# Altium schematic sheet Main.SchDoc
size A3; SheetNumber: 1; SheetTotal: 13
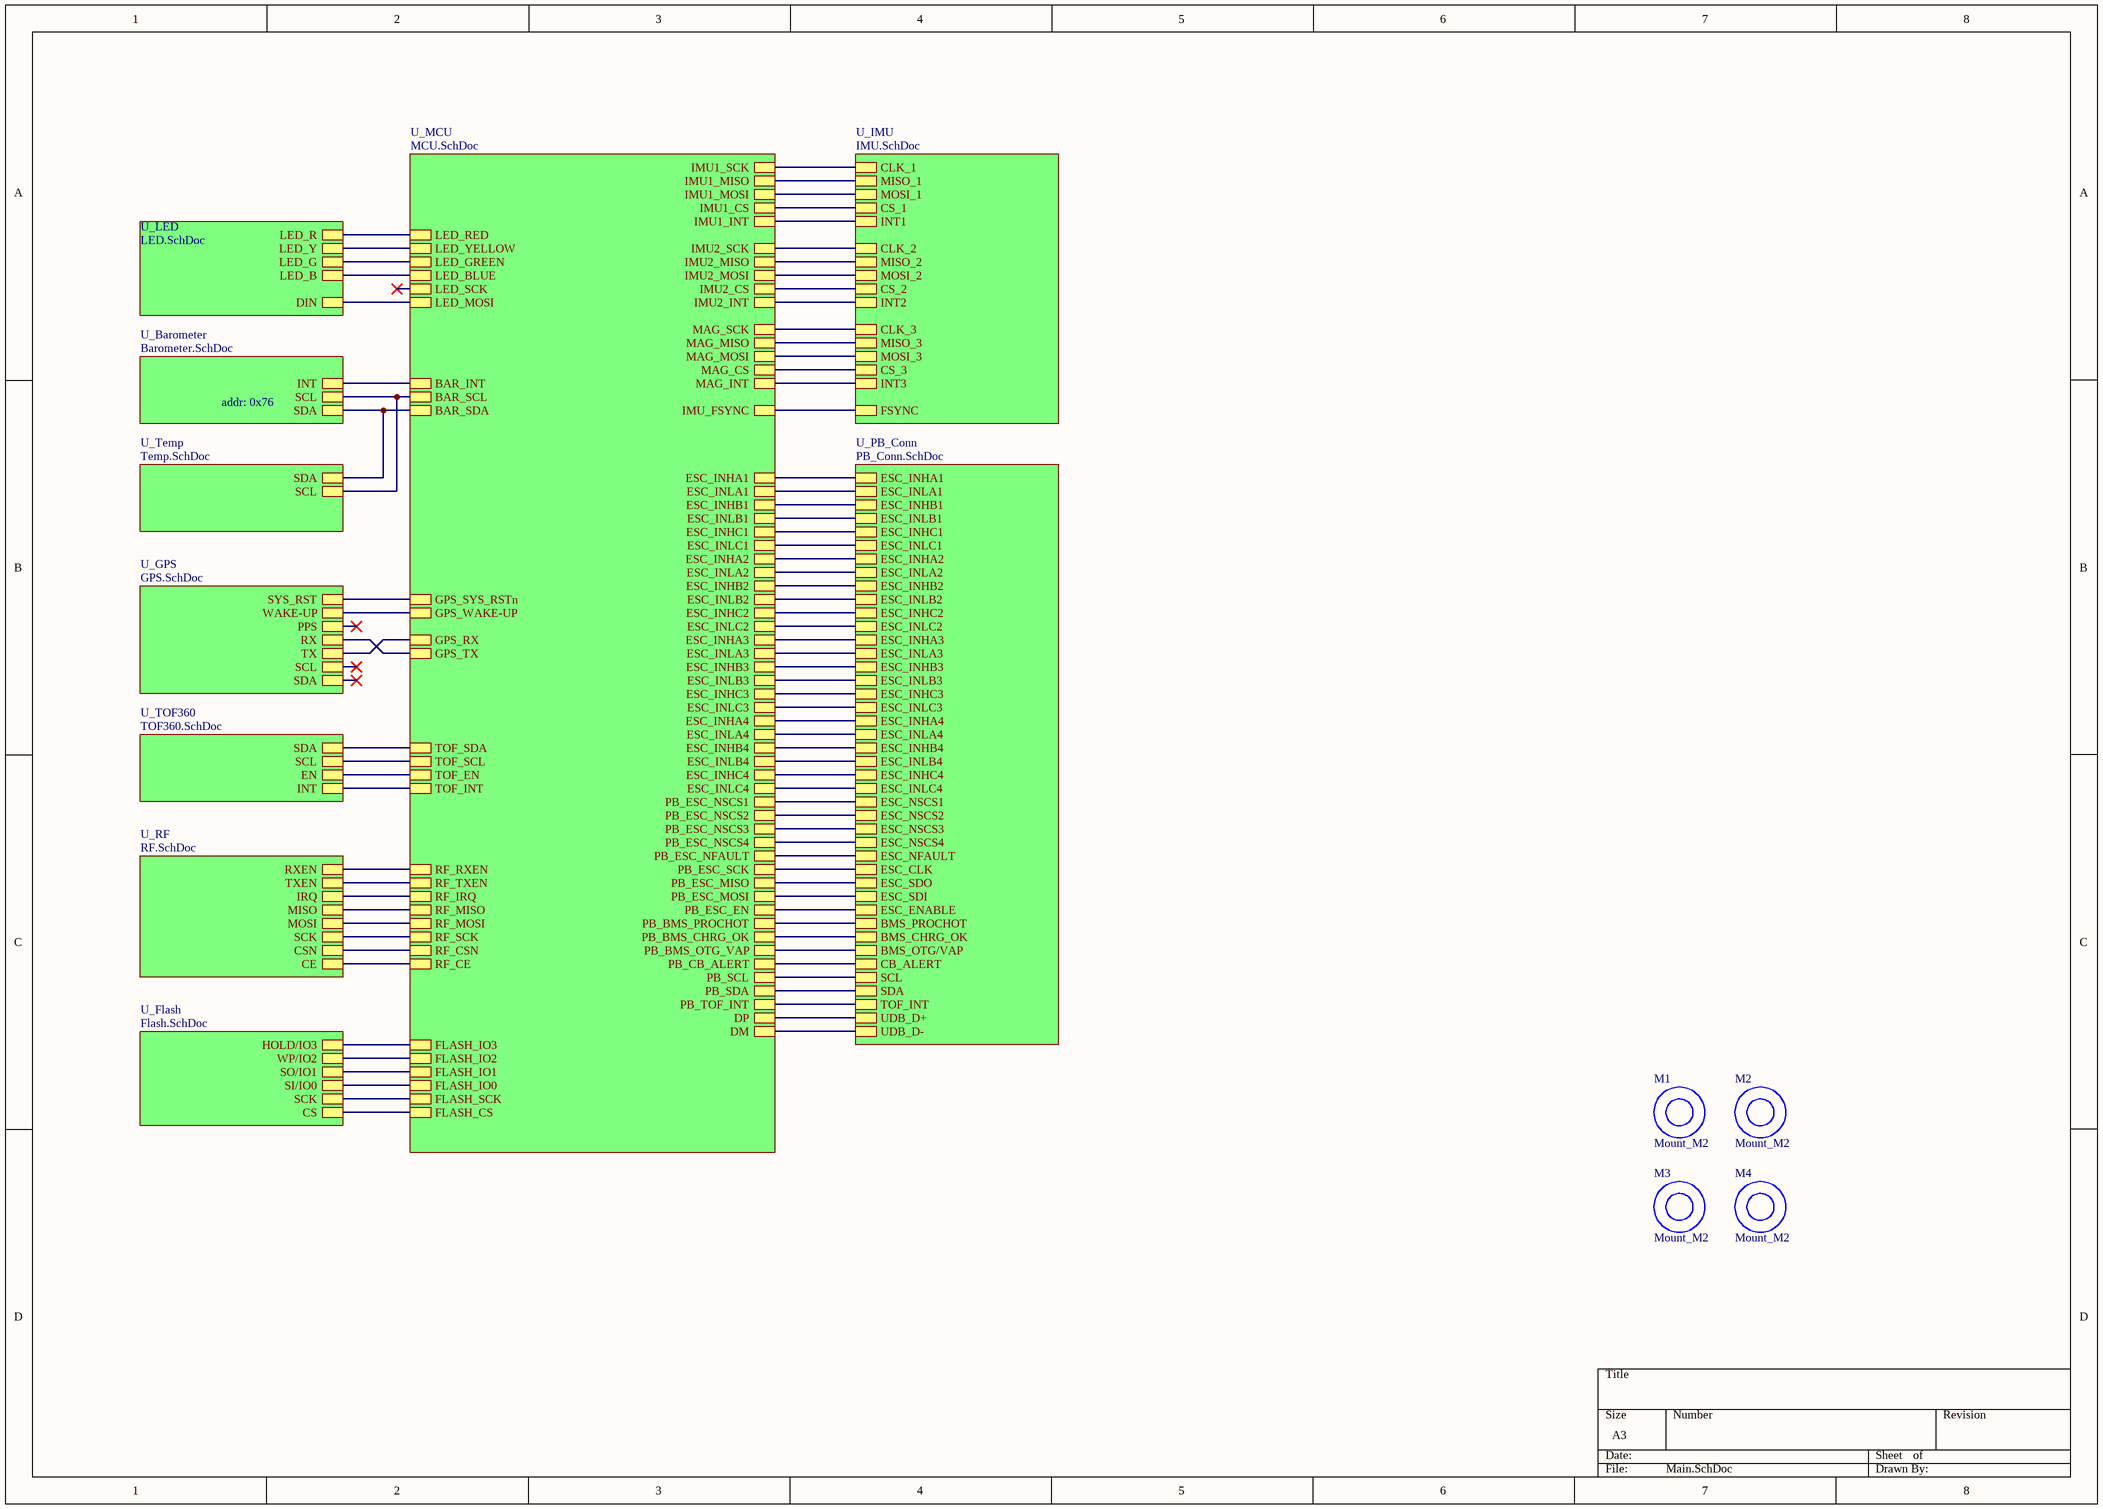
[diagram p0: Main.SchDoc]

## Parts
M1  Mount_M2  [Mount_M2_anti_vibration_rubber]
M2  Mount_M2  [Mount_M2_anti_vibration_rubber]
M3  Mount_M2  [Mount_M2_anti_vibration_rubber]
M4  Mount_M2  [Mount_M2_anti_vibration_rubber]

## Sub-sheets
U_Barometer = Barometer.SchDoc: SDA, SCL, INT
U_Flash = Flash.SchDoc: CS, SO/IO1, WP/IO2, HOLD/IO3, SCK, SI/IO0
U_GPS = GPS.SchDoc: SDA, SCL, TX, RX, PPS, WAKE-UP, SYS_RST
U_IMU = IMU.SchDoc: INT1, INT2, MISO_1, MOSI_1, CS_1, CLK_1, FSYNC, MISO_2, MOSI_2, CS_2, CLK_2, MOSI_3, CS_3, CLK_3, MISO_3, INT3
U_LED = LED.SchDoc: DIN, LED_R, LED_G, LED_Y, LED_B
U_MCU = MCU.SchDoc: DP, DM, TOF_SDA, TOF_SCL, TOF_EN, TOF_INT, ESC_INHA1, ESC_INHA2, ESC_INHA3, ESC_INHA4, ESC_INHB1, ESC_INHC1, ESC_INHB2, ESC_INHB3, ESC_INHB4, ESC_INHC2, ESC_INHC3, ESC_INHC4, ESC_INLA1, ESC_INLB1, ESC_INLC1, ESC_INLA2, ESC_INLA3, ESC_INLA4, ESC_INLB2, ESC_INLB3, ESC_INLB4, ESC_INLC2, ESC_INLC3, ESC_INLC4, RF_IRQ, RF_CSN, RF_MOSI, RF_MISO, RF_SCK, RF_CE, RF_RXEN, RF_TXEN, PB_SCL, PB_SDA, PB_TOF_INT, PB_ESC_EN, PB_ESC_SCK, PB_ESC_MISO, PB_ESC_MOSI, PB_ESC_NSCS1, PB_ESC_NSCS2, PB_ESC_NSCS3, PB_ESC_NSCS4, PB_BMS_PROCHOT, PB_BMS_OTG_VAP, PB_BMS_CHRG_OK, PB_CB_ALERT, PB_ESC_NFAULT, FLASH_IO0, FLASH_IO1, FLASH_IO2, FLASH_IO3, FLASH_SCK, FLASH_CS, GPS_RX, GPS_TX, GPS_WAKE-UP, GPS_SYS_RSTn, BAR_SCL, BAR_SDA, BAR_INT, LED_MOSI, LED_SCK, LED_RED, LED_GREEN, IMU1_SCK, IMU1_MISO, IMU1_MOSI, IMU1_CS, IMU1_INT, IMU2_INT, IMU2_SCK, IMU2_MISO, IMU2_MOSI, IMU2_CS, MAG_SCK, MAG_MISO, MAG_MOSI, MAG_CS, MAG_INT, IMU_FSYNC, LED_YELLOW, LED_BLUE
U_PB_Conn = PB_Conn.SchDoc: ESC_INLA1, ESC_INLB1, ESC_INLC1, ESC_INLA2, ESC_INLB2, ESC_INLC2, ESC_INLA3, ESC_INLB3, ESC_INLC3, ESC_INHA4, ESC_INLB4, ESC_INLC4, ESC_NSCS1, ESC_INHA1, ESC_INHB1, ESC_INHC1, ESC_INHA2, ESC_INHB2, ESC_INHC2, ESC_INHA3, ESC_INHB3, ESC_INHC3, ESC_INLA4, ESC_INHB4, ESC_INHC4, ESC_NSCS2, ESC_NSCS3, ESC_NSCS4, ESC_NFAULT, ESC_CLK, ESC_SDO, ESC_SDI, ESC_ENABLE, BMS_PROCHOT, BMS_CHRG_OK, BMS_OTG/VAP, CB_ALERT, SCL, SDA, TOF_INT, UDB_D+, UDB_D-
U_RF = RF.SchDoc: CE, CSN, SCK, MOSI, MISO, IRQ, TXEN, RXEN
U_Temp = Temp.SchDoc: SDA, SCL
U_TOF360 = TOF360.SchDoc: INT, SCL, SDA, EN

## Nets
(unnamed): sheet U_MCU/DP, sheet U_PB_Conn/UDB_D+
(unnamed): sheet U_MCU/DM, sheet U_PB_Conn/UDB_D-
(unnamed): sheet U_MCU/TOF_SDA, sheet U_TOF360/SDA
(unnamed): sheet U_MCU/TOF_SCL, sheet U_TOF360/SCL
(unnamed): sheet U_MCU/TOF_EN, sheet U_TOF360/EN
(unnamed): sheet U_MCU/TOF_INT, sheet U_TOF360/INT
(unnamed): sheet U_MCU/ESC_INHA1, sheet U_PB_Conn/ESC_INHA1
(unnamed): sheet U_MCU/ESC_INHA2, sheet U_PB_Conn/ESC_INHA2
(unnamed): sheet U_MCU/ESC_INHA3, sheet U_PB_Conn/ESC_INHA3
(unnamed): sheet U_MCU/ESC_INHA4, sheet U_PB_Conn/ESC_INHA4
(unnamed): sheet U_MCU/ESC_INHB1, sheet U_PB_Conn/ESC_INHB1
(unnamed): sheet U_MCU/ESC_INHC1, sheet U_PB_Conn/ESC_INHC1
(unnamed): sheet U_MCU/ESC_INHB2, sheet U_PB_Conn/ESC_INHB2
(unnamed): sheet U_MCU/ESC_INHB3, sheet U_PB_Conn/ESC_INHB3
(unnamed): sheet U_MCU/ESC_INHB4, sheet U_PB_Conn/ESC_INHB4
(unnamed): sheet U_MCU/ESC_INHC2, sheet U_PB_Conn/ESC_INHC2
(unnamed): sheet U_MCU/ESC_INHC3, sheet U_PB_Conn/ESC_INHC3
(unnamed): sheet U_MCU/ESC_INHC4, sheet U_PB_Conn/ESC_INHC4
(unnamed): sheet U_MCU/ESC_INLA1, sheet U_PB_Conn/ESC_INLA1
(unnamed): sheet U_MCU/ESC_INLB1, sheet U_PB_Conn/ESC_INLB1
(unnamed): sheet U_MCU/ESC_INLC1, sheet U_PB_Conn/ESC_INLC1
(unnamed): sheet U_MCU/ESC_INLA2, sheet U_PB_Conn/ESC_INLA2
(unnamed): sheet U_MCU/ESC_INLA3, sheet U_PB_Conn/ESC_INLA3
(unnamed): sheet U_MCU/ESC_INLA4, sheet U_PB_Conn/ESC_INLA4
(unnamed): sheet U_MCU/ESC_INLB2, sheet U_PB_Conn/ESC_INLB2
(unnamed): sheet U_MCU/ESC_INLB3, sheet U_PB_Conn/ESC_INLB3
(unnamed): sheet U_MCU/ESC_INLB4, sheet U_PB_Conn/ESC_INLB4
(unnamed): sheet U_MCU/ESC_INLC2, sheet U_PB_Conn/ESC_INLC2
(unnamed): sheet U_MCU/ESC_INLC3, sheet U_PB_Conn/ESC_INLC3
(unnamed): sheet U_MCU/ESC_INLC4, sheet U_PB_Conn/ESC_INLC4
(unnamed): sheet U_MCU/RF_IRQ, sheet U_RF/IRQ
(unnamed): sheet U_MCU/RF_CSN, sheet U_RF/CSN
(unnamed): sheet U_MCU/RF_MOSI, sheet U_RF/MOSI
(unnamed): sheet U_MCU/RF_MISO, sheet U_RF/MISO
(unnamed): sheet U_MCU/RF_SCK, sheet U_RF/SCK
(unnamed): sheet U_MCU/RF_CE, sheet U_RF/CE
(unnamed): sheet U_MCU/RF_RXEN, sheet U_RF/RXEN
(unnamed): sheet U_MCU/RF_TXEN, sheet U_RF/TXEN
(unnamed): sheet U_MCU/PB_SCL, sheet U_PB_Conn/SCL
(unnamed): sheet U_MCU/PB_SDA, sheet U_PB_Conn/SDA
(unnamed): sheet U_MCU/PB_TOF_INT, sheet U_PB_Conn/TOF_INT
(unnamed): sheet U_MCU/PB_ESC_EN, sheet U_PB_Conn/ESC_ENABLE
(unnamed): sheet U_MCU/PB_ESC_SCK, sheet U_PB_Conn/ESC_CLK
(unnamed): sheet U_MCU/PB_ESC_MISO, sheet U_PB_Conn/ESC_SDO
(unnamed): sheet U_MCU/PB_ESC_MOSI, sheet U_PB_Conn/ESC_SDI
(unnamed): sheet U_MCU/PB_ESC_NSCS1, sheet U_PB_Conn/ESC_NSCS1
(unnamed): sheet U_MCU/PB_ESC_NSCS2, sheet U_PB_Conn/ESC_NSCS2
(unnamed): sheet U_MCU/PB_ESC_NSCS3, sheet U_PB_Conn/ESC_NSCS3
(unnamed): sheet U_MCU/PB_ESC_NSCS4, sheet U_PB_Conn/ESC_NSCS4
(unnamed): sheet U_MCU/PB_BMS_PROCHOT, sheet U_PB_Conn/BMS_PROCHOT
(unnamed): sheet U_MCU/PB_BMS_OTG_VAP, sheet U_PB_Conn/BMS_OTG/VAP
(unnamed): sheet U_MCU/PB_BMS_CHRG_OK, sheet U_PB_Conn/BMS_CHRG_OK
(unnamed): sheet U_MCU/PB_CB_ALERT, sheet U_PB_Conn/CB_ALERT
(unnamed): sheet U_MCU/PB_ESC_NFAULT, sheet U_PB_Conn/ESC_NFAULT
(unnamed): sheet U_MCU/FLASH_IO0, sheet U_Flash/SI/IO0
(unnamed): sheet U_MCU/FLASH_IO1, sheet U_Flash/SO/IO1
(unnamed): sheet U_MCU/FLASH_IO2, sheet U_Flash/WP/IO2
(unnamed): sheet U_MCU/FLASH_IO3, sheet U_Flash/HOLD/IO3
(unnamed): sheet U_MCU/FLASH_SCK, sheet U_Flash/SCK
(unnamed): sheet U_MCU/FLASH_CS, sheet U_Flash/CS
(unnamed): sheet U_MCU/GPS_RX, sheet U_GPS/TX
(unnamed): sheet U_MCU/GPS_TX, sheet U_GPS/RX
(unnamed): sheet U_MCU/GPS_WAKE-UP, sheet U_GPS/WAKE-UP
(unnamed): sheet U_MCU/GPS_SYS_RSTn, sheet U_GPS/SYS_RST
(unnamed): sheet U_MCU/BAR_SCL, sheet U_Barometer/SCL, sheet U_Temp/SCL
(unnamed): sheet U_MCU/BAR_SDA, sheet U_Barometer/SDA, sheet U_Temp/SDA
(unnamed): sheet U_MCU/BAR_INT, sheet U_Barometer/INT
(unnamed): sheet U_MCU/LED_MOSI, sheet U_LED/DIN
(unnamed): sheet U_MCU/LED_RED, sheet U_LED/LED_R
(unnamed): sheet U_MCU/LED_GREEN, sheet U_LED/LED_G
(unnamed): sheet U_MCU/IMU1_SCK, sheet U_IMU/CLK_1
(unnamed): sheet U_MCU/IMU1_MISO, sheet U_IMU/MISO_1
(unnamed): sheet U_MCU/IMU1_MOSI, sheet U_IMU/MOSI_1
(unnamed): sheet U_MCU/IMU1_CS, sheet U_IMU/CS_1
(unnamed): sheet U_MCU/IMU1_INT, sheet U_IMU/INT1
(unnamed): sheet U_MCU/IMU2_INT, sheet U_IMU/INT2
(unnamed): sheet U_MCU/IMU2_SCK, sheet U_IMU/CLK_2
(unnamed): sheet U_MCU/IMU2_MISO, sheet U_IMU/MISO_2
(unnamed): sheet U_MCU/IMU2_MOSI, sheet U_IMU/MOSI_2
(unnamed): sheet U_MCU/IMU2_CS, sheet U_IMU/CS_2
(unnamed): sheet U_MCU/MAG_SCK, sheet U_IMU/CLK_3
(unnamed): sheet U_MCU/MAG_MISO, sheet U_IMU/MISO_3
(unnamed): sheet U_MCU/MAG_MOSI, sheet U_IMU/MOSI_3
(unnamed): sheet U_MCU/MAG_CS, sheet U_IMU/CS_3
(unnamed): sheet U_MCU/MAG_INT, sheet U_IMU/INT3
(unnamed): sheet U_MCU/IMU_FSYNC, sheet U_IMU/FSYNC
(unnamed): sheet U_MCU/LED_YELLOW, sheet U_LED/LED_Y
(unnamed): sheet U_MCU/LED_BLUE, sheet U_LED/LED_B

## Notes on the sheet
- addr: 0x76